# EAGLE design sidepcb15-03 (EAGLE 7.7.0)
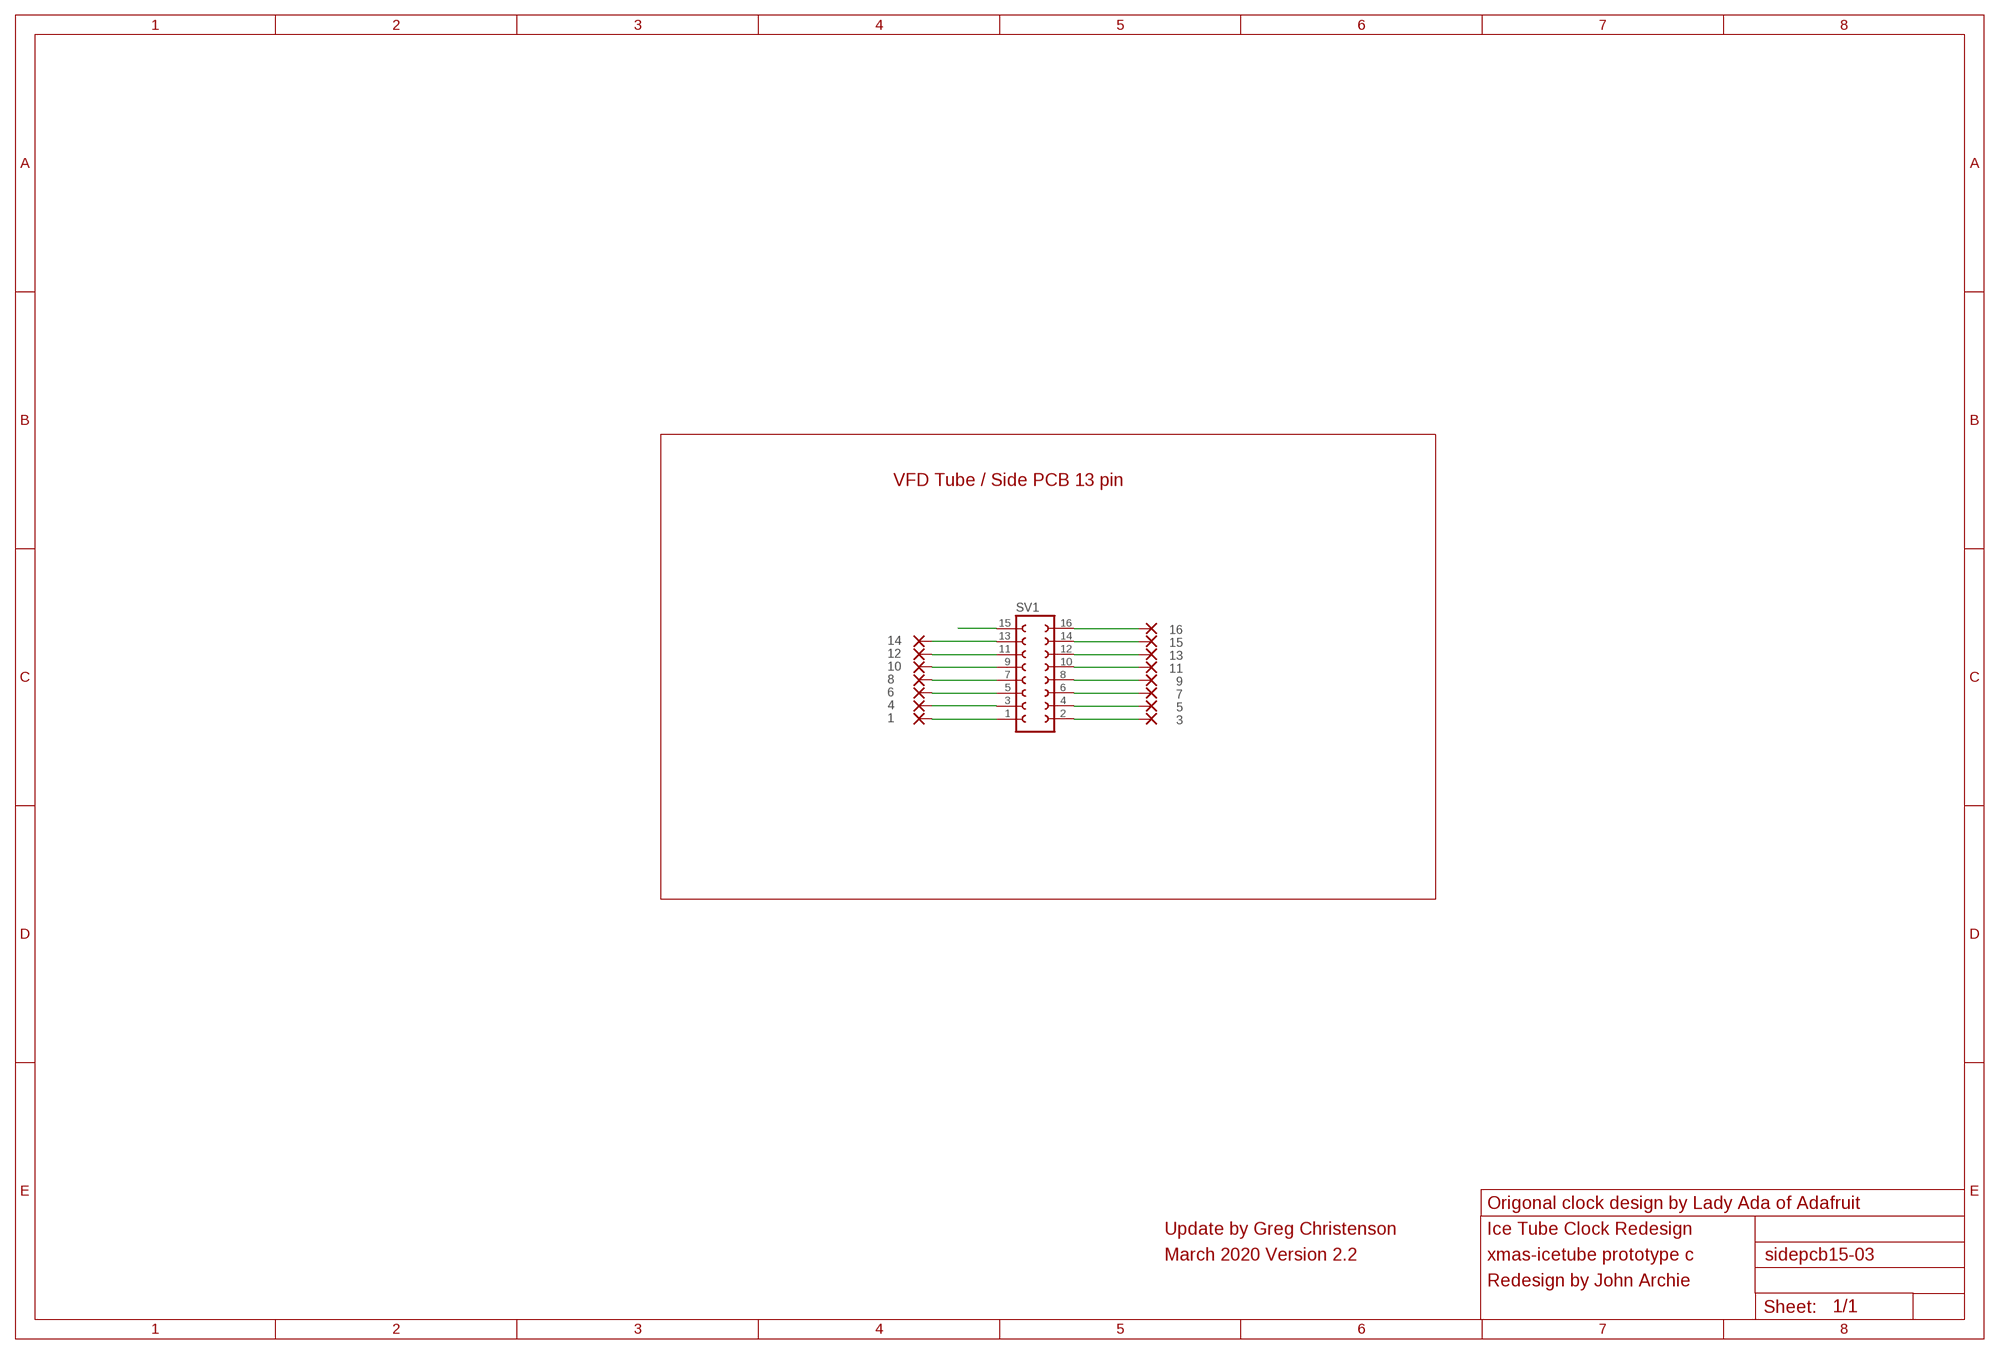
[diagram p0: schematic, sheet 1]

## Parts
1  1,6/0,8  [1,6/0,8]
3  1,6/0,8  [1,6/0,8]
4  1,6/0,8  [1,6/0,8]
5  1,6/0,8  [1,6/0,8]
6  1,6/0,8  [1,6/0,8]
7  1,6/0,8  [1,6/0,8]
8  1,6/0,8  [1,6/0,8]
9  1,6/0,8  [1,6/0,8]
10  1,6/0,8  [1,6/0,8]
11  1,6/0,8  [1,6/0,8]
12  1,6/0,8  [1,6/0,8]
13  1,6/0,8  [1,6/0,8]
14  1,6/0,8  [1,6/0,8]
15  1,6/0,8  [1,6/0,8]
16  1,6/0,8  [1,6/0,8]
SV1  FE08-2W  [FE08-2W]

## Nets
E-A,W: 3.1(P) SV1.2
E-B: 16.1(P) SV1.16
E-C,S: 13.1(P) SV1.12
E-D: 12.1(P) SV1.11
E-E: 14.1(P) SV1.13
E-F: 1.1(P) SV1.1
E-G,M: 15.1(P) SV1.14
E-P: 11.1(P) SV1.10
G8: 8.1(P) SV1.7
G9: 7.1(P) SV1.6
G10: 6.1(P) SV1.5
G11: 5.1(P) SV1.4
G13: 9.1(P) SV1.8
G14: 10.1(P) SV1.9
G-12: 4.1(P) SV1.3
GND: SV1.15

## Notes on the sheet
- VFD Tube / Side PCB 13 pin
- Origonal clock design by Lady Ada of Adafruit
- Update by Greg Christenson | Ice Tube Clock Redesign
- March 2020 Version 2.2 | xmas-icetube prototype c
- Redesign by John Archie

## Library data of the parts
1 3-16 = wirepad:1,6/0,8: THROUGH-HOLE PAD
SV1 = con-lsta:FE08-2W: FEMALE HEADER; OC_FARNELL: unknown; OC_NEWARK: unknown

## Net classes
0 default: clearance 0.205 mm

## Board
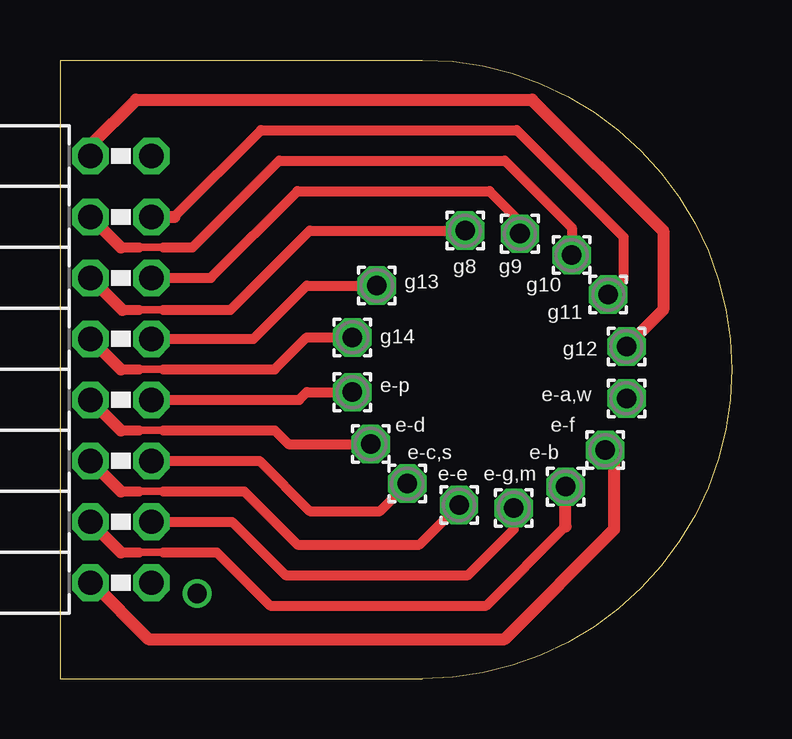
[diagram p1: board, top side]
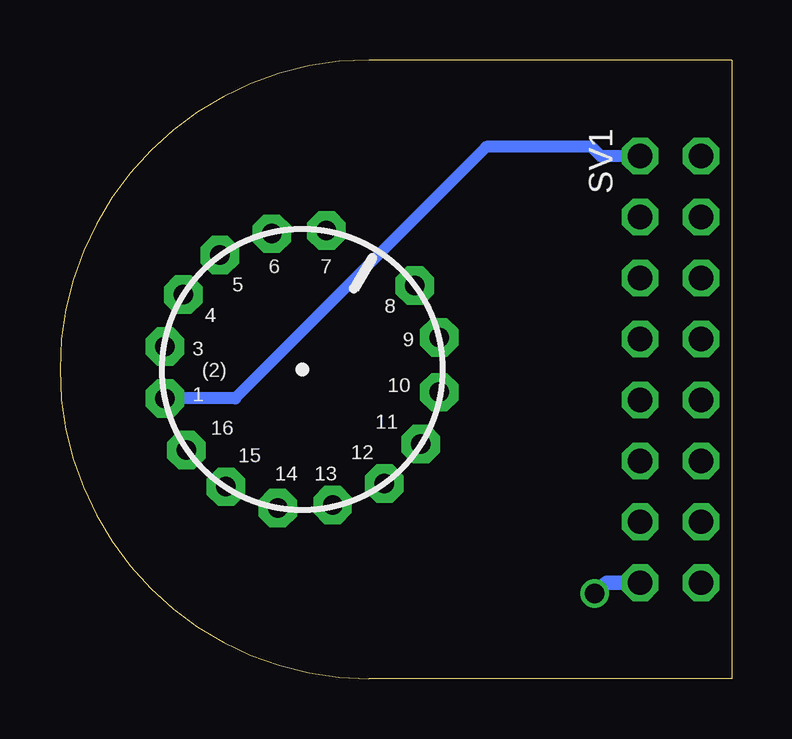
[diagram p2: board, bottom side, seen from below]

Size 28 x 25.78 mm. Coordinates in mm from the lower left corner, seen from the top.
Outline: 0,25.78 0,0 15.11,0 arc180 15.11,25.78 0,25.78
Copper layers (1*16): Top 0.0356mm / dielectric 1.5011mm / Bottom 0.0356mm
Design rules "LaenPCBOrder *": minimum track width 8mil, minimum drill 9mil, track to track 10mil, track to pad 10mil, pad to pad 10mil, via to via 10mil, smd to smd 8mil, copper to edge 15mil, drill to drill 6mil, minimum pad ring 7mil, minimum via ring 7mil, stop-mask expansion 4mil, vias tented up to drill 20mil, thermal gap 10mil

### Footprints (pad centres in the part's own frame; a part is rotated, then mirrored left to right if it is on the bottom)
1,6/0,8 = drill 0.813 pad 1.6 octagon: 1 0,0
FE08-2W = drill 1.016 octagon: 1 -8.89,1.27; 2 -8.89,-1.27; 3 -6.35,1.27; 4 -6.35,-1.27; 5 -3.81,1.27; 6 -3.81,-1.27; 7 -1.27,1.27; 8 -1.27,-1.27; 9 1.27,1.27; 10 1.27,-1.27; 11 3.81,1.27; 12 3.81,-1.27; 13 6.35,1.27; 14 6.35,-1.27; 15 8.89,1.27; 16 8.89,-1.27

### Placement (x,y rotation side)
1  23.62,11.68 0 top
3  23.62,13.84 0 top
4  22.86,16 0 top
5  21.34,17.65 0 top
6  19.18,18.54 0 top
7  16.89,18.67 0 top
8  13.21,16.38 0 top
9  12.19,14.22 0 top
10  12.19,11.94 0 top
11  12.95,9.78 0 top
12  14.48,8.13 0 top
13  16.64,7.24 0 top
14  18.92,7.11 0 top
15  21.08,8 0 top
16  22.73,9.53 0 top
SV1  2.54,12.89 270 top

### Tracks (layer width: path | path; a pad name or v marks a point on that pad's centre or on a via)
E-A,W
  Top 0.508: SV1.2 1.27,22.23 3.17,24.13 19.69,24.13 25.15,18.67 25.15,15.37 3.1
E-B
  Top 0.406: SV1.16 1.33,4
  Top 0.508: 1.33,4 3.68,1.65 18.54,1.65 23.11,6.22 23.11,9.14 16.1
E-C,S
  Top 0.305: 3.3,7.81 4.32,7.81
  Top 0.406: 2.54,7.81 3.3,7.81 | 4.32,7.81 7.68,7.81 9.91,5.59 14.99,5.59 13.1
  Top 0.508: SV1.12 2.54,7.81
E-D
  Top 0.406: SV1.11 8.32,9.08 10.41,6.99 13.33,6.99 12.1
E-E
  Top 0.406: SV1.13 7.17,6.54 9.4,4.32 17.02,4.32 18.92,6.22 14.1
E-F
  Bottom 0.457: 10.22,22.16 20.7,11.68
  Bottom 0.508: SV1.1 5.46,21.78 5.84,22.16 10.22,22.16 | 20.7,11.68 1.1
E-G,M
  Top 0.305: 3.3,5.27 4.32,5.27
  Top 0.406: 2.54,5.27 3.3,5.27 | 4.32,5.27 6.54,5.27 8.76,3.05 17.78,3.05 21.08,6.35
  Top 0.508: SV1.14 2.54,5.27 | 21.08,6.35 15.1
E-P
  Top 0.305: 3.3,10.35 4.32,10.35
  Top 0.406: 2.54,10.35 3.3,10.35 | 4.32,10.35 8.95,10.35 9.53,9.78 11.1
  Top 0.508: SV1.10 2.54,10.35
G8
  Top 0.406: SV1.7 8.06,14.16 10.29,16.38 8.1
G9
  Top 0.305: 3.3,15.37 4.32,15.37
  Top 0.406: 2.6,15.37 3.3,15.37 | 4.32,15.37 7.11,15.37 10.41,18.67 7.1
  Top 0.508: SV1.6 2.6,15.37
G10
  Top 0.406: SV1.5 6.29,16.7 9.91,20.32 17.91,20.32 19.18,19.05
  Top 0.508: 19.18,19.05 6.1
G11
  Top 0.305: 3.3,17.97 4.32,17.97
  Top 0.406: 2.54,17.97 3.3,17.97 | 4.32,17.97 5.53,17.97 9.14,21.59 18.54,21.59 21.34,18.8 5.1
  Top 0.508: SV1.4 2.54,17.97
G13
  Top 0.305: 3.3,12.89 4.32,12.89
  Top 0.406: 2.54,12.89 3.3,12.89 | 4.32,12.89 8.95,12.89 10.29,14.22 9.1
  Top 0.508: SV1.8 2.54,12.89
G14
  Top 0.406: SV1.9 9.97,11.62 10.29,11.94 10.1
G-12
  Top 0.406: 4.76,19.24 8.38,22.86 19.05,22.86 23.49,18.41 23.49,16.64 4.1
  Top 0.508: SV1.3 4.76,19.24
GND  (via drill 0.8)
  Bottom 0.61: SV1.15 5.21,4 v5.71,3.56

### Text on the board
tNames: g8 | g9 | g13 | g10 | g11 | g14 | g12 | e-p | e-a,w | e-d | e-f | e-c,s | e-b | e-e | e-g,m
bNames: (2)